# Altium schematic sheet Matrix.SchDoc: Thermistors array
size A4; DrawnBy: Maxime Tousignant-Tremblay; Revision: 1; SheetNumber: 1; SheetTotal: 1
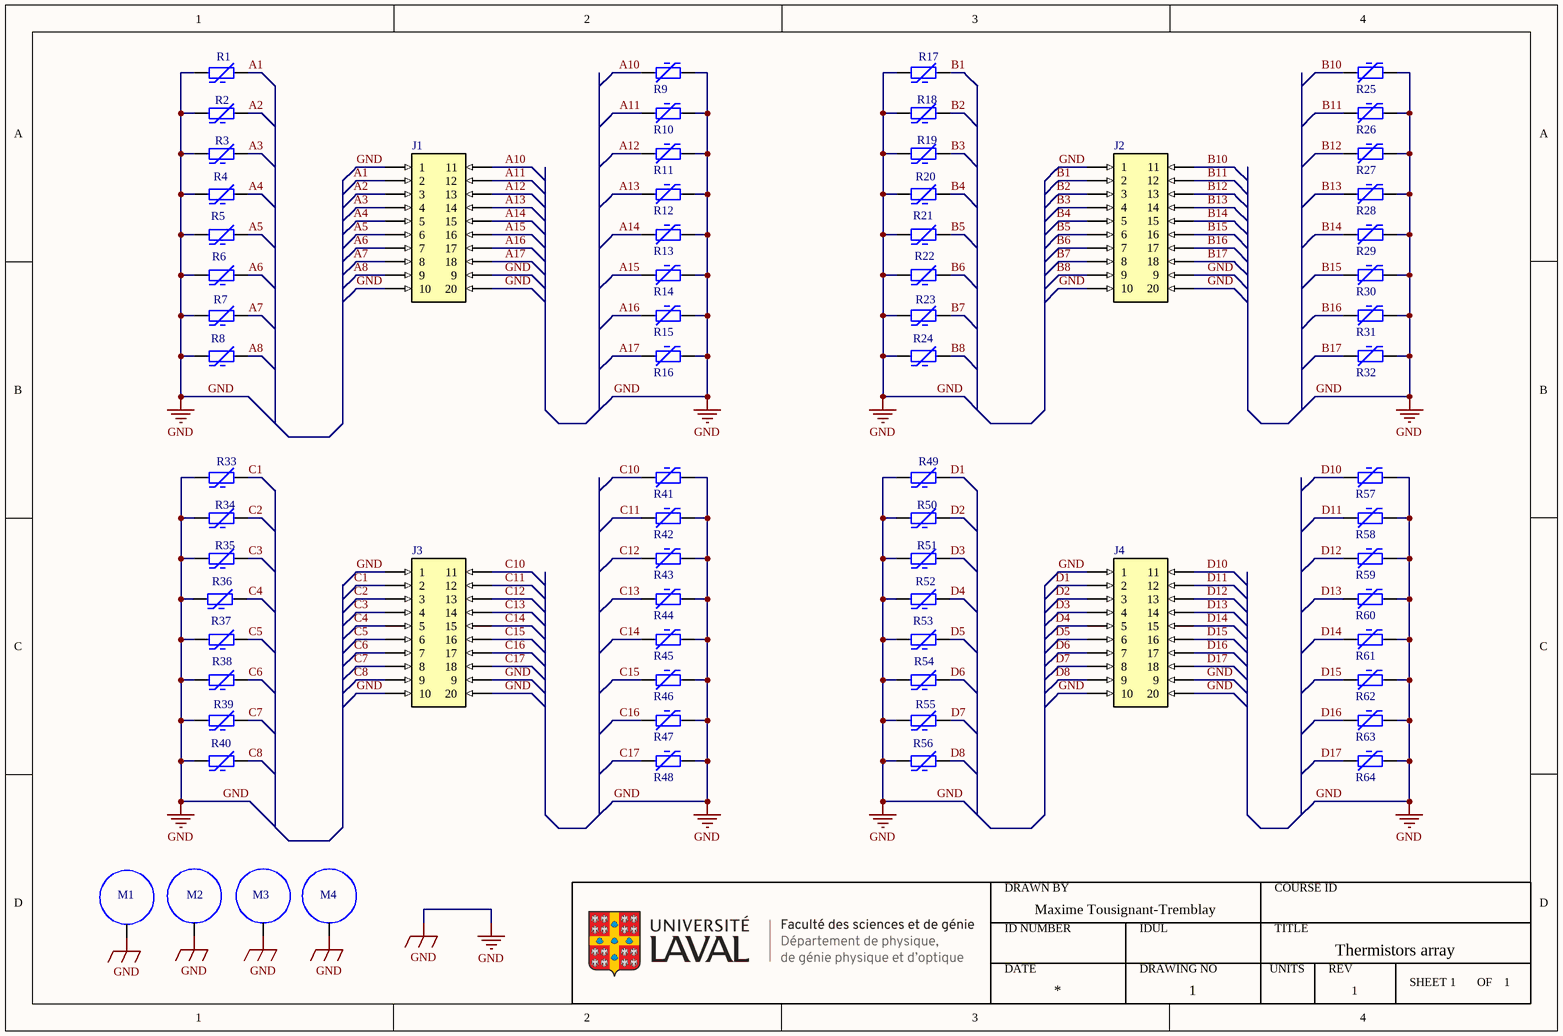
[diagram p0: Matrix.SchDoc]

## Parts
J1  NPPN102AFCN-RC  [Header Connector 20 Pos 0.079" (2.00mm) - A]  (value not drawn)
J2  NPPN102AFCN-RC  [Header Connector 20 Pos 0.079" (2.00mm) - A]  (value not drawn)
J3  NPPN102AFCN-RC  [Header Connector 20 Pos 0.079" (2.00mm) - A]  (value not drawn)
J4  NPPN102AFCN-RC  [Header Connector 20 Pos 0.079" (2.00mm) - A]  (value not drawn)
M1  971050354  [Standoff M3 5mm Brass]  (value not drawn)
M2  971050354  [Standoff M3 5mm Brass]  (value not drawn)
M3  971050354  [Standoff M3 5mm Brass]  (value not drawn)
M4  971050354  [Standoff M3 5mm Brass]  (value not drawn)
R1  NTCLE413E2103F524A  [Thermistors NTC 10K 1% Bead - A]  (value not drawn)
R2  NTCLE413E2103F524A  [Thermistors NTC 10K 1% Bead - A]  (value not drawn)
R3  NTCLE413E2103F524A  [Thermistors NTC 10K 1% Bead - A]  (value not drawn)
R4  NTCLE413E2103F524A  [Thermistors NTC 10K 1% Bead - A]  (value not drawn)
R5  NTCLE413E2103F524A  [Thermistors NTC 10K 1% Bead - A]  (value not drawn)
R6  NTCLE413E2103F524A  [Thermistors NTC 10K 1% Bead - A]  (value not drawn)
R7  NTCLE413E2103F524A  [Thermistors NTC 10K 1% Bead - A]  (value not drawn)
R8  NTCLE413E2103F524A  [Thermistors NTC 10K 1% Bead - A]  (value not drawn)
R9  NTCLE413E2103F524A  [Thermistors NTC 10K 1% Bead - A]  (value not drawn)
R10  NTCLE413E2103F524A  [Thermistors NTC 10K 1% Bead - A]  (value not drawn)
R11  NTCLE413E2103F524A  [Thermistors NTC 10K 1% Bead - A]  (value not drawn)
R12  NTCLE413E2103F524A  [Thermistors NTC 10K 1% Bead - A]  (value not drawn)
R13  NTCLE413E2103F524A  [Thermistors NTC 10K 1% Bead - A]  (value not drawn)
R14  NTCLE413E2103F524A  [Thermistors NTC 10K 1% Bead - A]  (value not drawn)
R15  NTCLE413E2103F524A  [Thermistors NTC 10K 1% Bead - A]  (value not drawn)
R16  NTCLE413E2103F524A  [Thermistors NTC 10K 1% Bead - A]  (value not drawn)
R17  NTCLE413E2103F524A  [Thermistors NTC 10K 1% Bead - A]  (value not drawn)
R18  NTCLE413E2103F524A  [Thermistors NTC 10K 1% Bead - A]  (value not drawn)
R19  NTCLE413E2103F524A  [Thermistors NTC 10K 1% Bead - A]  (value not drawn)
R20  NTCLE413E2103F524A  [Thermistors NTC 10K 1% Bead - A]  (value not drawn)
R21  NTCLE413E2103F524A  [Thermistors NTC 10K 1% Bead - A]  (value not drawn)
R22  NTCLE413E2103F524A  [Thermistors NTC 10K 1% Bead - A]  (value not drawn)
R23  NTCLE413E2103F524A  [Thermistors NTC 10K 1% Bead - A]  (value not drawn)
R24  NTCLE413E2103F524A  [Thermistors NTC 10K 1% Bead - A]  (value not drawn)
R25  NTCLE413E2103F524A  [Thermistors NTC 10K 1% Bead - A]  (value not drawn)
R26  NTCLE413E2103F524A  [Thermistors NTC 10K 1% Bead - A]  (value not drawn)
R27  NTCLE413E2103F524A  [Thermistors NTC 10K 1% Bead - A]  (value not drawn)
R28  NTCLE413E2103F524A  [Thermistors NTC 10K 1% Bead - A]  (value not drawn)
R29  NTCLE413E2103F524A  [Thermistors NTC 10K 1% Bead - A]  (value not drawn)
R30  NTCLE413E2103F524A  [Thermistors NTC 10K 1% Bead - A]  (value not drawn)
R31  NTCLE413E2103F524A  [Thermistors NTC 10K 1% Bead - A]  (value not drawn)
R32  NTCLE413E2103F524A  [Thermistors NTC 10K 1% Bead - A]  (value not drawn)
R33  NTCLE413E2103F524A  [Thermistors NTC 10K 1% Bead - A]  (value not drawn)
R34  NTCLE413E2103F524A  [Thermistors NTC 10K 1% Bead - A]  (value not drawn)
R35  NTCLE413E2103F524A  [Thermistors NTC 10K 1% Bead - A]  (value not drawn)
R36  NTCLE413E2103F524A  [Thermistors NTC 10K 1% Bead - A]  (value not drawn)
R37  NTCLE413E2103F524A  [Thermistors NTC 10K 1% Bead - A]  (value not drawn)
R38  NTCLE413E2103F524A  [Thermistors NTC 10K 1% Bead - A]  (value not drawn)
R39  NTCLE413E2103F524A  [Thermistors NTC 10K 1% Bead - A]  (value not drawn)
R40  NTCLE413E2103F524A  [Thermistors NTC 10K 1% Bead - A]  (value not drawn)
R41  NTCLE413E2103F524A  [Thermistors NTC 10K 1% Bead - A]  (value not drawn)
R42  NTCLE413E2103F524A  [Thermistors NTC 10K 1% Bead - A]  (value not drawn)
R43  NTCLE413E2103F524A  [Thermistors NTC 10K 1% Bead - A]  (value not drawn)
R44  NTCLE413E2103F524A  [Thermistors NTC 10K 1% Bead - A]  (value not drawn)
R45  NTCLE413E2103F524A  [Thermistors NTC 10K 1% Bead - A]  (value not drawn)
R46  NTCLE413E2103F524A  [Thermistors NTC 10K 1% Bead - A]  (value not drawn)
R47  NTCLE413E2103F524A  [Thermistors NTC 10K 1% Bead - A]  (value not drawn)
R48  NTCLE413E2103F524A  [Thermistors NTC 10K 1% Bead - A]  (value not drawn)
R49  NTCLE413E2103F524A  [Thermistors NTC 10K 1% Bead - A]  (value not drawn)
R50  NTCLE413E2103F524A  [Thermistors NTC 10K 1% Bead - A]  (value not drawn)
R51  NTCLE413E2103F524A  [Thermistors NTC 10K 1% Bead - A]  (value not drawn)
R52  NTCLE413E2103F524A  [Thermistors NTC 10K 1% Bead - A]  (value not drawn)
R53  NTCLE413E2103F524A  [Thermistors NTC 10K 1% Bead - A]  (value not drawn)
R54  NTCLE413E2103F524A  [Thermistors NTC 10K 1% Bead - A]  (value not drawn)
R55  NTCLE413E2103F524A  [Thermistors NTC 10K 1% Bead - A]  (value not drawn)
R56  NTCLE413E2103F524A  [Thermistors NTC 10K 1% Bead - A]  (value not drawn)
R57  NTCLE413E2103F524A  [Thermistors NTC 10K 1% Bead - A]  (value not drawn)
R58  NTCLE413E2103F524A  [Thermistors NTC 10K 1% Bead - A]  (value not drawn)
R59  NTCLE413E2103F524A  [Thermistors NTC 10K 1% Bead - A]  (value not drawn)
R60  NTCLE413E2103F524A  [Thermistors NTC 10K 1% Bead - A]  (value not drawn)
R61  NTCLE413E2103F524A  [Thermistors NTC 10K 1% Bead - A]  (value not drawn)
R62  NTCLE413E2103F524A  [Thermistors NTC 10K 1% Bead - A]  (value not drawn)
R63  NTCLE413E2103F524A  [Thermistors NTC 10K 1% Bead - A]  (value not drawn)
R64  NTCLE413E2103F524A  [Thermistors NTC 10K 1% Bead - A]  (value not drawn)

## Nets
GND: J1.1 J1.10 J1.19(9) J1.20 J2.1 J2.10 J2.19(9) J2.20 J3.1 J3.10 J3.19(9) J3.20 J4.1 J4.10 J4.19(9) J4.20 M1.1(CGND) M2.1(CGND) M3.1(CGND) M4.1(CGND) R1.1 R2.1 R3.1 R4.1 R5.1 R6.1 R7.1 R8.1 R9.1 R10.1 R11.1 R12.1 R13.1 R14.1 R15.1 R16.1 R17.1 R18.1 R19.1 R20.1 R21.1 R22.1 R23.1 R24.1 R25.1 R26.1 R27.1 R28.1 R29.1 R30.1 R31.1 R32.1 R33.1 R34.1 R35.1 R36.1 R37.1 R38.1 R39.1 R40.1 R41.1 R42.1 R43.1 R44.1 R45.1 R46.1 R47.1 R48.1 R49.1 R50.1 R51.1 R52.1 R53.1 R54.1 R55.1 R56.1 R57.1 R58.1 R59.1 R60.1 R61.1 R62.1 R63.1 R64.1
A1: J1.2 R1.2
A2: J1.3 R2.2
A3: J1.4 R3.2
A4: J1.5 R4.2
A5: J1.6 R5.2
A6: J1.7 R6.2
A7: J1.8 R7.2
A8: J1.9 R8.2
A10: J1.11 R9.2
A11: J1.12 R10.2
A12: J1.13 R11.2
A13: J1.14 R12.2
A14: J1.15 R13.2
A15: J1.16 R14.2
A16: J1.17 R15.2
A17: J1.18 R16.2
B1: J2.2 R17.2
B2: J2.3 R18.2
B3: J2.4 R19.2
B4: J2.5 R20.2
B5: J2.6 R21.2
B6: J2.7 R22.2
B7: J2.8 R23.2
B8: J2.9 R24.2
B10: J2.11 R25.2
B11: J2.12 R26.2
B12: J2.13 R27.2
B13: J2.14 R28.2
B14: J2.15 R29.2
B15: J2.16 R30.2
B16: J2.17 R31.2
B17: J2.18 R32.2
C1: J3.2 R33.2
C2: J3.3 R34.2
C3: J3.4 R35.2
C4: J3.5 R36.2
C5: J3.6 R37.2
C6: J3.7 R38.2
C7: J3.8 R39.2
C8: J3.9 R40.2
C10: J3.11 R41.2
C11: J3.12 R42.2
C12: J3.13 R43.2
C13: J3.14 R44.2
C14: J3.15 R45.2
C15: J3.16 R46.2
C16: J3.17 R47.2
C17: J3.18 R48.2
D1: J4.2 R49.2
D2: J4.3 R50.2
D3: J4.4 R51.2
D4: J4.5 R52.2
D5: J4.6 R53.2
D6: J4.7 R54.2
D7: J4.8 R55.2
D8: J4.9 R56.2
D10: J4.11 R57.2
D11: J4.12 R58.2
D12: J4.13 R59.2
D13: J4.14 R60.2
D14: J4.15 R61.2
D15: J4.16 R62.2
D16: J4.17 R63.2
D17: J4.18 R64.2

## Notes on the sheet
- DRAWN BY
- COURSE ID
- ID NUMBER
- DATE
- IDUL
- DRAWING NO
- TITLE
- UNITS
- REV
- SHEET
- OF

## Library data of the parts
J1-J4 = Header Connector 20 Pos 0.079" (2.00mm): 20 Position Header Connector 0.079" (2.00mm) Through Hole Gold; Supplier 1: Digi-Key; Supplier Part Number 1: S5750-10-ND
M1-M4 = Standoff M3 5mm: Hex Standoff Threaded M3 Brass 0.197" (5.00mm) Silver; Supplier 1: Digi-Key; Supplier Part Number 1: 732-12899-ND
R1-R64 = Thermistors NTC 10K 1% Bead: NTC Thermistor 10k Bead, Epoxy; Supplier 1: Digi-Key; Supplier Part Number 1: 56-NTCLE413E2103F524A-ND; ComponentLink1Description: Datasheet; ComponentLink1URL: https://www.vishay.com/docs/29078/ntcle413.pdf
  R1 R3-R14 R16 R17 R19-R30 R32 R33 R35-R46 R48 R49 R51-R62 R64: Value: 10K